# Altium schematic sheet Car_board.SchDoc
size A2; SheetNumber: 1; SheetTotal: 1
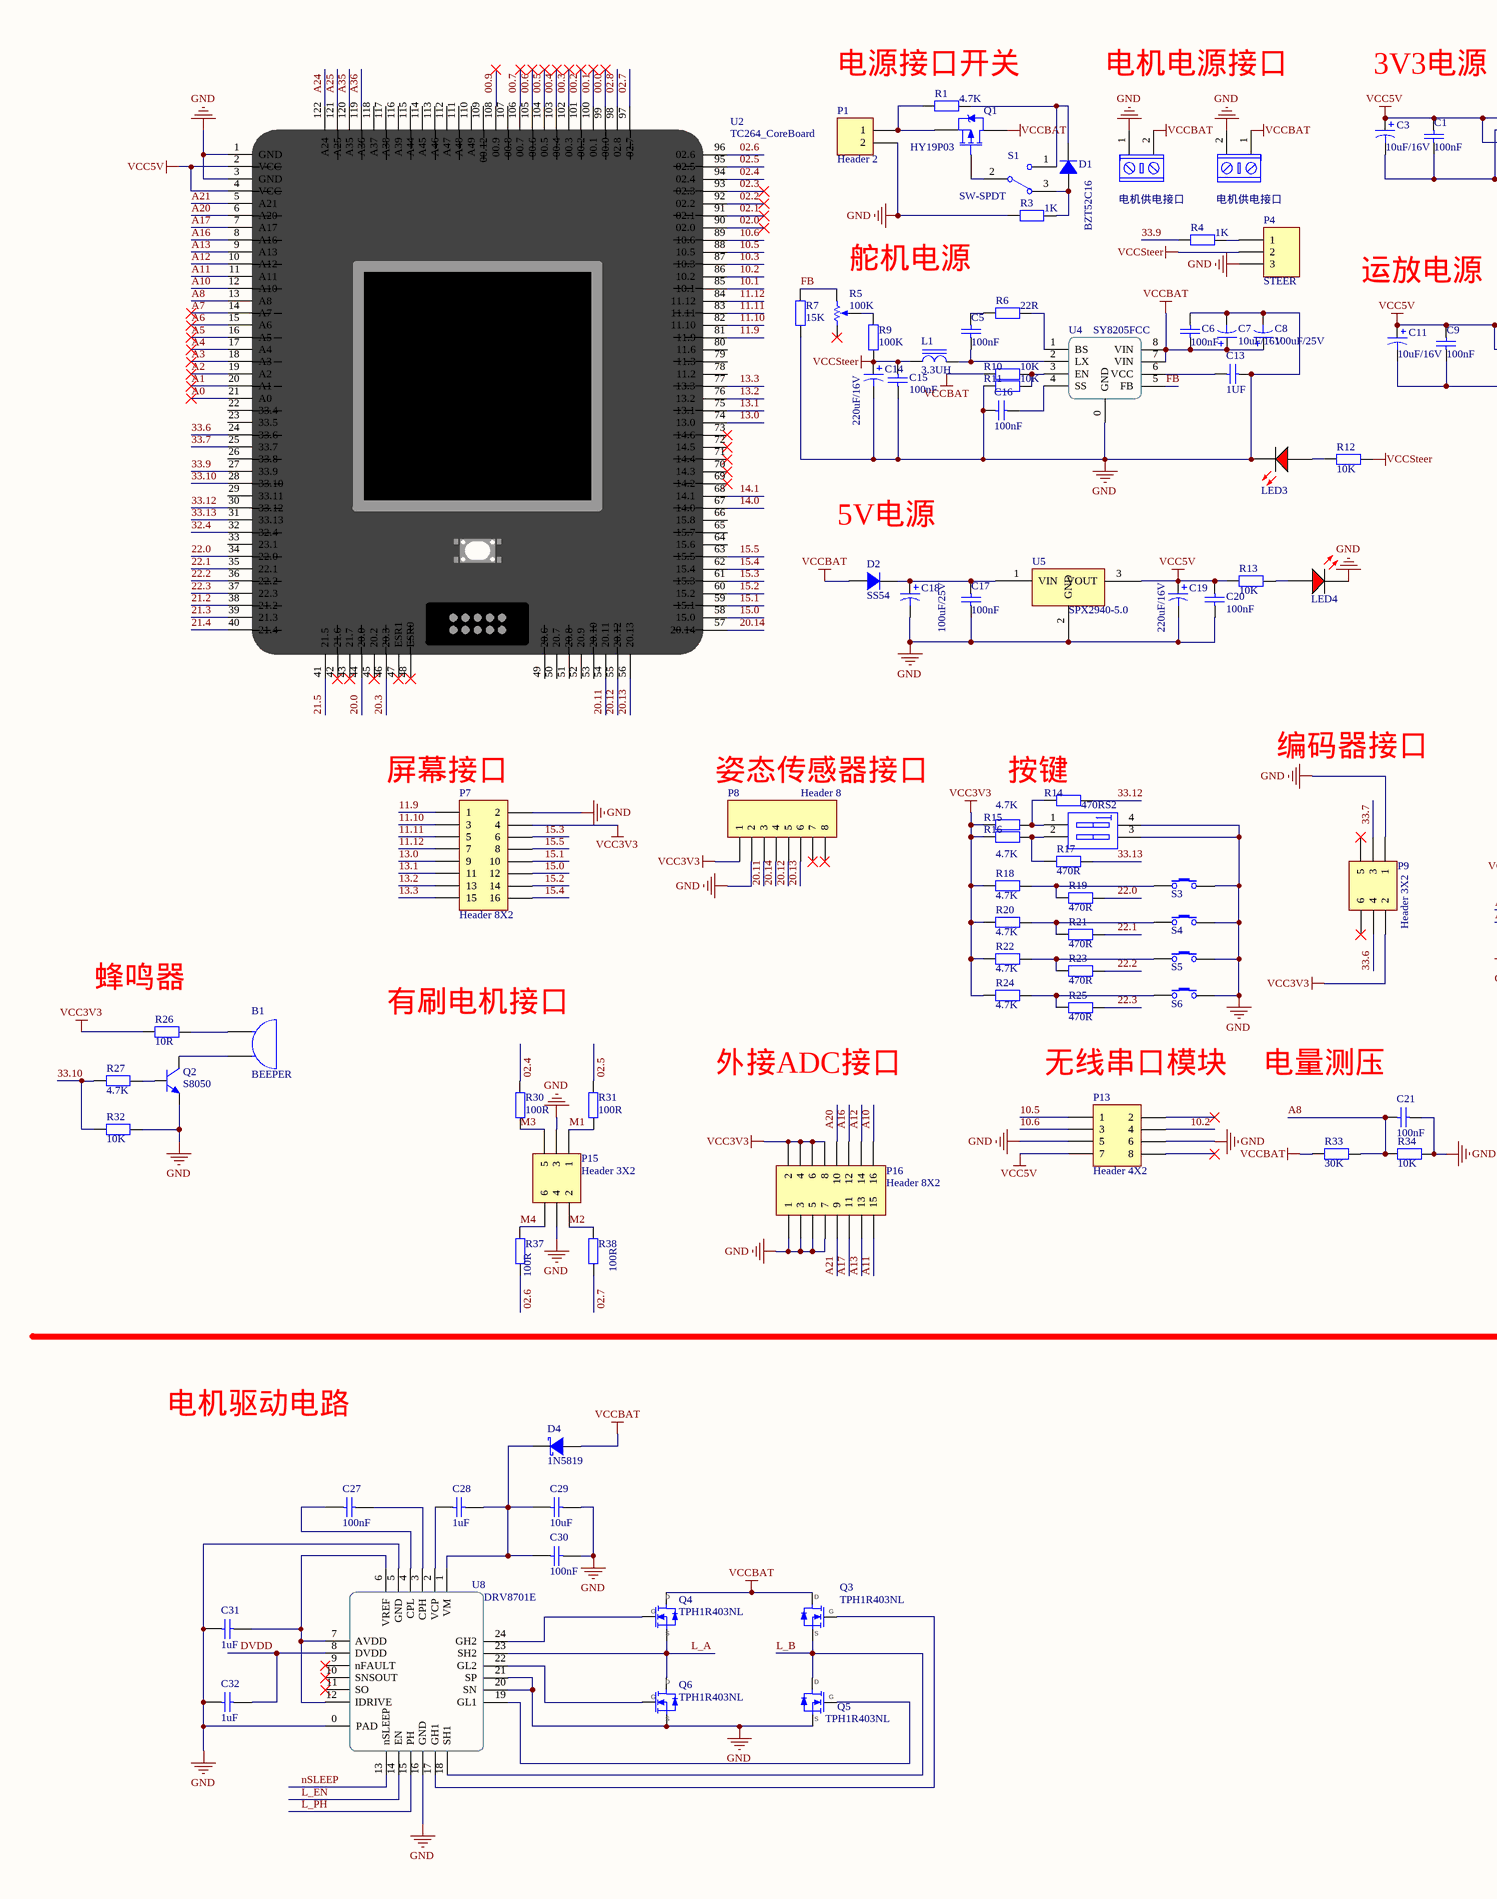
[diagram p0: Car_board.SchDoc, left]
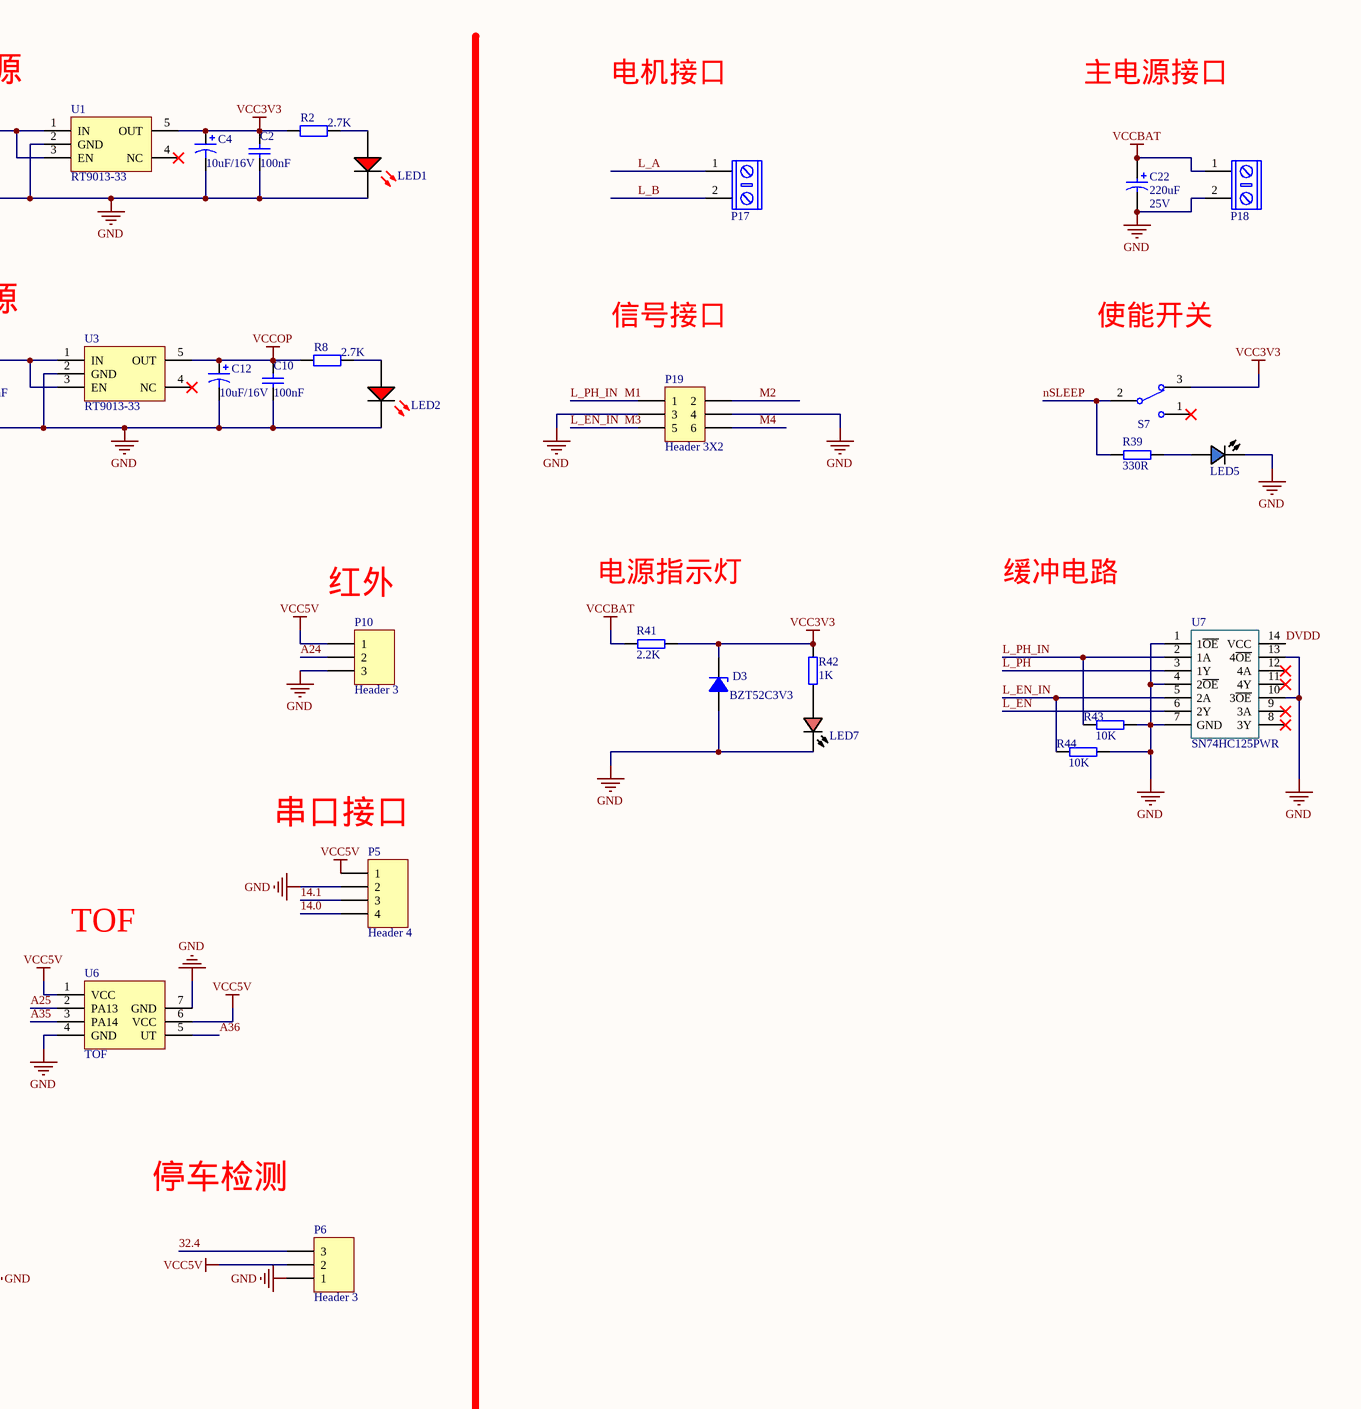
[diagram p1: Car_board.SchDoc, right]

## Parts
B1  BEEPER  [BEEPER]
C1  value 100nF  [0603C]  (hidden comment: Cap)
C2  value 100nF  [0603C]  (hidden comment: Cap)
C3  value 10uF/16V  [3216]  (hidden comment: Cap Pol2)
C4  value 10uF/16V  [3216]  (hidden comment: Cap Pol2)
C5  value 100nF  [0603C]  (hidden comment: Cap)
C6  value 100nF  [0603C]  (hidden comment: Cap)
C7  value 10uF/16V  [3216]  (hidden comment: Cap Pol2)
C8  value 100uF/25V  [CAPSO_6.3*7.7]  (hidden comment: Cap Pol2)
C9  value 100nF  [0603C]  (hidden comment: Cap)
C10  value 100nF  [0603C]  (hidden comment: Cap)
C11  value 10uF/16V  [3216]  (hidden comment: Cap Pol2)
C12  value 10uF/16V  [3216]  (hidden comment: Cap Pol2)
C13  value 1UF  [0603C]  (hidden comment: Cap)
C14  value 220uF/16V  [CAPSO_6.3*7.7]  (hidden comment: Cap Pol2)
C15  value 100nF  [0603C]  (hidden comment: Cap)
C16  value 100nF  [0603C]  (hidden comment: Cap)
C17  value 100nF  [0603C]  (hidden comment: Cap)
C18  value 100uF/25V  [CAPSO_6.3*7.7]  (hidden comment: Cap Pol2)
C19  value 220uF/16V  [CAPSO_6.3*7.7]  (hidden comment: Cap Pol2)
C20  value 100nF  [0603C]  (hidden comment: Cap)
C21  value 100nF  [0603C]  (hidden comment: Cap)
C22  value 220uF  Voltage: 25V  [CAPPR3.5-8X11.5]  (hidden comment: 220uF 25V)
C27  value 100nF  [CAPC1608[0603]S-N]  (hidden comment: 100nF ±10% 50V)
C28  value 1uF  [CAPC1608[0603]S-N]  (hidden comment: 1uF ±10% 25V)
C29  value 10uF  [CAPC2012[0805]S-N]  (hidden comment: 10uF ±10% 25V)
C30  value 100nF  [CAPC1608[0603]S-N]  (hidden comment: 100nF ±10% 50V)
C31  value 1uF  [CAPC1608[0603]S-N]  (hidden comment: 1uF ±10% 25V)
C32  value 1uF  [CAPC1608[0603]S-N]  (hidden comment: 1uF ±10% 25V)
D1  BZT52C16  [SOD-123]
D2  SS54  [SOD-123]
D3  BZT52C3V3  [SOD-123-L]
D4  1N5819  [SOD-123-L]
L1  3.3UH  [L-0630]
LED1  LED 3R  [0805D]  (value not drawn)
LED2  LED 3R  [0805D]  (value not drawn)
LED3  LED 3R  [0805D]  (value not drawn)
LED4  LED 3R  [0805D]  (value not drawn)
LED5  Blue  [LEDC1608(0603)]  (value not drawn)
LED7  (no value)  [LEDC1608(0603)]
P1  Header 2  [PCBComponent_1]
P2  电机供电接口  [KF/WJ/DG 301-2p-5.0mm]
P3  电机供电接口  [KF/WJ/DG 301-2p-5.0mm]
P4  STEER  [HDR1X3]
P5  Header 4  [HDR1X4]
P6  Header 3  [HDR1X3]
P7  Header 8X2  [HDR2X8]
P8  Header 8  [HDR1X8]
P9  Header 3X2  [HDR2X3]
P10  Header 3  [HDR1X3]
P13  Header 4X2  [HDR2X4]
P15  Header 3X2  [HDR2X3]
P16  Header 8X2  [HDR2X8]
P17  KF/WJ/DG 30x connecter  [KF/WJ/DG 301-2p-5.0mm]  (value not drawn)
P18  KF/WJ/DG 30x connecter  [KF/WJ/DG 301-2p-5.0mm]  (value not drawn)
P19  Header 3X2  [HDR2X3]
Q1  HY19P03  [TO-252]
Q2  S8050  [SOT-23]
Q3  TPH1R403NL  [DFN5x6]
Q4  TPH1R403NL  [DFN5x6]
Q5  TPH1R403NL  [DFN5x6]
Q6  TPH1R403NL  [DFN5x6]
R1  value 4.7K  [0603R]  (hidden comment: Res2)
R2  value 2.7K  [0603R]  (hidden comment: Res2)
R3  value 1K  [0603R]  (hidden comment: Res2)
R4  value 1K  [0603R]  (hidden comment: Res2)
R5  value 100K  [VR5_N]  (hidden comment: RPot)
R6  value 22R  [0603R]  (hidden comment: Res2)
R7  value 15K  [0603R]  (hidden comment: Res2)
R8  value 2.7K  [0603R]  (hidden comment: Res2)
R9  value 100K  [0603R]  (hidden comment: Res2)
R10  value 10K  [0603R]  (hidden comment: Res2)
R11  value 10K  [0603R]  (hidden comment: Res2)
R12  value 10K  [0603R]  (hidden comment: Res2)
R13  value 10K  [0603R]  (hidden comment: Res2)
R14  value 470R  [0603R]  (hidden comment: Res2)
R15  value 4.7K  [0603R]  (hidden comment: Res2)
R16  value 4.7K  [0603R]  (hidden comment: Res2)
R17  value 470R  [0603R]  (hidden comment: Res2)
R18  value 4.7K  [0603R]  (hidden comment: Res2)
R19  value 470R  [0603R]  (hidden comment: Res2)
R20  value 4.7K  [0603R]  (hidden comment: Res2)
R21  value 470R  [0603R]  (hidden comment: Res2)
R22  value 4.7K  [0603R]  (hidden comment: Res2)
R23  value 470R  [0603R]  (hidden comment: Res2)
R24  value 4.7K  [0603R]  (hidden comment: Res2)
R25  value 470R  [0603R]  (hidden comment: Res2)
R26  value 10R  [0603R]  (hidden comment: Res2)
R27  value 4.7K  [0603R]  (hidden comment: Res2)
R30  value 100R  [0603R]  (hidden comment: Res2)
R31  value 100R  [0603R]  (hidden comment: Res2)
R32  value 10K  [0603R]  (hidden comment: Res2)
R33  value 30K  [0603R]  (hidden comment: Res2)
R34  value 10K  [0603R]  (hidden comment: Res2)
R37  value 100R  [0603R]  (hidden comment: Res2)
R38  value 100R  [0603R]  (hidden comment: Res2)
R39  value 330R  [RESC1608[0603]S-N]  (hidden comment: 330R ±1%)
R41  value 2.2K  [RESC1608[0603]S-N]  (hidden comment: 2.2K ±1%)
R42  value 1K  [RESC1608[0603]S-N]  (hidden comment: 1K ±1%)
R43  value 10K  [RESC1608[0603]S-N]  (hidden comment: 10K ±1%)
R44  value 10K  [RESC1608[0603]S-N]  (hidden comment: 10K ±1%)
S1  SW-SPDT  [扭子开关102 - 2]
S2  SW DIP-2  [DIP4]  (value not drawn)
S3  Button  [KEY-2-SMD-3*6]  (value not drawn)
S4  Button  [KEY-2-SMD-3*6]  (value not drawn)
S5  Button  [KEY-2-SMD-3*6]  (value not drawn)
S6  Button  [KEY-2-SMD-3*6]  (value not drawn)
S7  SW-SPDT  [SS12D10]  (value not drawn)
U1  RT9013-33  [SOT-23-5]
U2  TC264_CoreBoard  [TC264_CoreBoard]
U3  RT9013-33  [SOT-23-5]
U4  SY8205FCC  [SOP-8E]
U5  SPX2940-5.0  [TO-263-3]
U6  TOF  [TOF]
U7  SN74HC125PWR  [TSSOP-14]
U8  DRV8701E  [QFN24-4x4]

## Nets
GND: C1.1 C2.1 C3.2 C4.2 C6.1 C7.2 C8.2 C9.1 C10.1 C11.2 C12.2 C13.2 C14.2 C15.2 C16.2 C17.1 C18.2 C19.2 C20.2 C21.1 C22.2 C29.2 C30.2 C31.1 C32.1 D3.A LED1.2(K) LED2.2(K) LED3.2(K) LED4.2(K) LED5.C LED7.C P1.2 P2.1 P3.2 P4.3 P5.2 P6.1 P7.2 P8.2 P9.1 P10.3 P13.5 P13.6 P15.3 P15.4 P16.1 P16.3 P16.5 P16.7 P18.2 P19.3 P19.4 Q2.2(E) Q5.3(S) Q6.3(S) R3.2 R7.1 R11.1 R32.1 R34.1 R43.2 R44.2 S2.3(B2) S2.4(B1) S3.1 S4.1 S5.1 S6.1 U1.2(GND) U2.1(GND) U2.3(GND) U3.2(GND) U4.0(GND) U5.2(GND) U6.4(GND) U6.7(GND) U7.1(1~{OE}) U7.4(2~{OE}) U7.7(GND) U7.10(3~{OE}) U7.13(4~{OE}) U8.0(PAD) U8.5(GND) U8.16(GND) U8.20(SN) U8.21(SP)
VCC3V3: C2.2 C4.1 D3.K P7.4 P8.1 P9.2 P16.2 P16.4 P16.6 P16.8 R2.1 R15.2 R16.2 R18.2 R20.2 R22.2 R24.2 R26.2 R41.2 R42.2 S7.3 U1.5(OUT)
VCC5V: C1.2 C3.1 C9.2 C11.1 C19.1 C20.1 P5.1 P6.2 P10.1 P13.7 R13.2 U1.1(IN) U1.3(EN) U2.2(VCC) U2.4(VCC) U3.1(IN) U3.3(EN) U5.3(VOUT) U6.1(VCC) U6.6(VCC)
VCCBAT: C6.2 C7.1 C8.1 C22.1 D2.1(A) D4.A P2.2 P3.1 P18.1 Q1.2(D) Q3.1(D) Q4.1(D) R10.1 R33.2 R41.1 U4.7(VIN) U4.8(VIN)
VCCOP: C10.2 C12.1 R8.1 U3.5(OUT)
VCCSteer: C14.1 C15.1 L1.1 P4.2 R9.1 R12.2
00.0: U2.99(00.0)
00.1: U2.100(00.1)
00.2: U2.101(00.2)
00.3: U2.102(00.3)
00.4: U2.103(00.4)
00.5: U2.104(00.5)
00.6: U2.105(00.6)
00.7: U2.106(00.7)
00.9: U2.108(00.9)
02.0: U2.90(02.0)
02.1: U2.91(02.1)
02.2: U2.92(02.2)
02.3: U2.93(02.3)
02.4: R30.1 U2.94(02.4)
02.5: R31.1 U2.95(02.5)
02.6: R37.2 U2.96(02.6)
02.7: R38.2 U2.97(02.7)
02.8: U2.98(02.8)
10.1: U2.85(10.1)
10.2: P13.4 U2.86(10.2)
10.3: U2.87(10.3)
10.5: P13.1 U2.88(10.5)
10.6: P13.3 U2.89(10.6)
11.9: P7.1 U2.81(11.9)
11.10: P7.3 U2.82(11.10)
11.11: P7.5 U2.83(11.11)
11.12: P7.7 U2.84(11.12)
13.0: P7.9 U2.74(13.0)
13.1: P7.11 U2.75(13.1)
13.2: P7.13 U2.76(13.2)
13.3: P7.15 U2.77(13.3)
14.0: P5.4 U2.67(14.0)
14.1: P5.3 U2.68(14.1)
15.0: P7.12 U2.58(15.0)
15.1: P7.10 U2.59(15.1)
15.2: P7.14 U2.60(15.2)
15.3: P7.6 U2.61(15.3)
15.4: P7.16 U2.62(15.4)
15.5: P7.8 U2.63(15.5)
20.0: U2.44(20.0)
20.3: U2.46(20.3)
20.11: P8.3 U2.54(20.11)
20.12: P8.5 U2.55(20.12)
20.13: P8.6 U2.56(20.13)
20.14: P8.4 U2.57(20.14)
21.2: U2.38(21.2)
21.3: U2.39(21.3)
21.4: U2.40(21.4)
21.5: U2.41(21.5)
22.0: R19.1 U2.34(22.0)
22.1: R21.1 U2.35(22.1)
22.2: R23.1 U2.36(22.2)
22.3: R25.1 U2.37(22.3)
32.4: P6.3 U2.32(32.4)
33.6: P9.4 U2.24(33.6)
33.7: P9.3 U2.25(33.7)
33.9: R4.1 U2.27(33.9)
33.10: R27.2 R32.2 U2.28(33.10)
33.12: R14.1 U2.30(33.12)
33.13: R17.1 U2.31(33.13)
A0: U2.21(A0)
A1: U2.20(A1)
A2: U2.19(A2)
A3: U2.18(A3)
A4: U2.17(A4)
A5: U2.16(A5)
A6: U2.15(A6)
A7: U2.14(A7)
A8: C21.2 R33.1 R34.2 U2.13(A8)
A10: P16.16 U2.12(A10)
A11: P16.15 U2.11(A11)
A12: P16.14 U2.10(A12)
A13: P16.13 U2.9(A13)
A16: P16.12 U2.8(A16)
A17: P16.11 U2.7(A17)
A20: P16.10 U2.6(A20)
A21: P16.9 U2.5(A21)
A24: P10.2 U2.122(A24)
A25: U2.121(A25) U6.2(PA13)
A35: U2.120(A35) U6.3(PA14)
A36: U2.119(A36) U6.5(UT)
DVDD: C32.2 U7.14(VCC) U8.8(DVDD)
FB: R5.3(BOT) R7.2 U4.5(FB)
L_A: P17.1 Q4.3(S) Q6.1(D) U8.23(SH2)
L_B: P17.2 Q3.3(S) Q5.1(D) U8.18(SH1)
L_EN: U7.6(2Y) U8.14(EN)
L_EN_IN: P15.5 P19.5 R30.2 R44.1 U7.5(2A)  [also labelled M3]
L_PH: U7.3(1Y) U8.15(PH)
L_PH_IN: P15.1 P19.1 R31.2 R43.1 U7.2(1A)  [also labelled M1]
M2: P15.2 P19.2 R38.1
M4: P15.6 P19.6 R37.1
nSLEEP: R39.1 S7.2 U8.13(nSLEEP)
NetB1_1: B1.1(A) R26.1
NetB1_2: B1.2(B) Q2.3(C)
NetC5_1: C5.1 L1.2 U4.2(LX)
NetC5_2: C5.2 R6.1
NetC13_1: C13.1 U4.6(VCC)
NetC16_1: C16.1 U4.4(SS)
NetC17_2: C17.2 C18.1 D2.2(K) U5.1(VIN)
NetC27_1: C27.1 U8.4(CPL)
NetC27_2: C27.2 U8.3(CPH)
NetC28_1: C28.1 U8.2(VCP)
NetC28_2: C28.2 C29.1 C30.1 D4.K U8.1(VM)
NetC31_2: C31.2 U8.6(VREF) U8.7(AVDD) U8.12(IDRIVE)
NetD1_1: D1.1(A) R3.1 S1.3
NetD1_2: D1.2(K) R1.1 S1.1
NetLED1_1: LED1.1(A) R2.2
NetLED2_1: LED2.1(A) R8.2
NetLED3_1: LED3.1(A) R12.1
NetLED4_1: LED4.1(A) R13.1
NetLED5_A: LED5.A R39.2
NetLED7_A: LED7.A R42.1
NetP1_1: P1.1 Q1.3(S) R1.2
NetP4_1: P4.1 R4.2
NetQ1_1: Q1.1(G) S1.2
NetQ2_1: Q2.1(B) R27.1
NetQ3_2: Q3.2(G) U8.17(GH1)
NetQ4_2: Q4.2(G) U8.24(GH2)
NetQ5_2: Q5.2(G) U8.19(GL1)
NetQ6_2: Q6.2(G) U8.22(GL2)
NetR5_2: R5.2(TAP) R9.2
NetR6_2: R6.2 U4.1(BS)
NetR10_2: R10.2 R11.2 U4.3(EN)
NetR14_2: R14.2 R15.1 S2.1(A1)
NetR16_1: R16.1 R17.2 S2.2(A2)
NetR18_1: R18.1 R19.2 S3.2
NetR20_1: R20.1 R21.2 S4.2
NetR22_1: R22.1 R23.2 S5.2
NetR24_1: R24.1 R25.2 S6.2

Not connected (* = marked no-connect by the designer): P8 7* 8*; P9 5* 6*; P13 2* 8*; R5 1(TOP)*; S7 1*; U1 4(NC)*; U2 22(33.4) 23(33.5) 26(33.8) 29(33.11) 33(23.1) 42(21.6)* 43(21.7)* 45(20.2)* 47(ESR1)* 48(ESR0)* 49(20.6) 50(20.7) 51(20.8) 52(20.9) 53(20.10) 64(15.6) 65(15.7) 66(15.8) 69(14.2)* 70(14.3)* 71(14.4)* 72(14.5)* 73(14.6)* 78(11.2) 79(11.3) 80(11.6) 107(00.8) 109(00.12) 110(A49) 111(A48) 112(A47) 113(A46) 114(A45) 115(A44) 116(A39) 117(A38) 118(A37); U3 4(NC)*; U7 8(3Y)* 9(3A)* 11(4Y)* 12(4A)*; U8 9(nFAULT)* 10(SNSOUT)* 11(SO)*

## Notes on the sheet
- (near R1) 电源接口开关
- 电机电源接口
- 3V3电源
- 电机接口
- 主电源接口
- (near R5) 舵机电源
- 运放电源
- 信号接口
- 使能开关
- 5V电源
- 电源指示灯
- 缓冲电路
- (near P10) 红外
- 编码器接口
- (near P5) 串口接口
- (near P7) 屏幕接口
- 姿态传感器接口
- (near R14) 按键
- TOF
- (near R26) 蜂鸣器
- 有刷电机接口
- 外接ADC接口
- 无线串口模块
- 电量测压
- 停车检测
- 电机驱动电路

## Library data of the parts
B1 = BUZZER: 3V蜂鸣器
C1 C2 C5 C6 C9 C10 C13 C15-C17 C20 C21 = Cap: 电容; PackageReference: RAD-0.3; Publisher: Altium Limited; PackageDescription: Radial Cap, Thru-Hole; 2 Leads; 0.3 in Pin Spacing
C3 C4 C7 C8 C11 C12 C14 C18 C19 = Cap Pol2: 钽电解电容/16V/A型封装; Published: 8-Jun-2000; LatestRevisionDate: 17-Jul-2002; LatestRevisionNote: Re-released for DXP Platform.; PackageReference: POLAR0.8; Publisher: Altium Limited; PackageDescription: Polarized Capacitor; 2 Leads
C22 = Cap-Elect: Polarized Capacitor (Radial); Published: 8-Jun-2000; Revision: July-2002: Re-released for DXP Platform.; Publisher: Altium Limited; Price(RMB): 0.000
C27 C30 = Cap-Chip_1: 贴片电容; Published: 8-Jun-2000; Revision: July-2002: Re-released for DXP Platform.; Publisher: Altium Limited; Price(RMB): 0.000; Voltage: 50V; Tolerance: ±10%
C28 C31 C32 = Cap-Chip_2: 贴片电容; Published: 8-Jun-2000; Revision: July-2002: Re-released for DXP Platform.; Publisher: Altium Limited; Price(RMB): 0.000; Voltage: 25V; Tolerance: ±10%
C29 = Cap-Chip: 贴片电容; Published: 8-Jun-2000; Revision: July-2002: Re-released for DXP Platform.; Publisher: Altium Limited; Price(RMB): 0.000; Voltage: 25V; Tolerance: ±10%
D1 D2 = TVS: TVS二极管 Diode; Imax: 500mA; Published: 8-Jun-2000; Revision: July-2002: Re-released for DXP Platform.; Publisher: Altium Limited; Price(RMB): 0.000
D3 = Diode Zen: 3.3V稳压二极管 SOD-123; Published: 8-Jun-2000; Revision: July-2002: Re-released for DXP Platform.; Publisher: Altium Limited; Price(RMB): 0.000
D4 = Diode Schottky: 肖特基二极管 Diode; Imax: 500mA; Published: 8-Jun-2000; Revision: July-2002: Re-released for DXP Platform.; Publisher: Altium Limited; Price(RMB): 0.000; PartNumber: 1N5819
L1 = Ind-Power: Power Inductor, Ferrite-Core; Imax: 50mA; DCR: .5m; Published: 8-Jun-2000; Revision: July-2002: Re-released for DXP Platform.; Publisher: Altium Limited; Price(RMB): 0.000; Value: 3.3UH
LED1-LED4 = LED DIP Red: Red, Typical INFRARED GaAs LED; Published: 8-Jun-2000; Revision: July-2002: Re-released for DXP Platform.; Publisher: Altium Limited; Price(RMB): 0.00
LED5 = LED Chip Blue: Typical Chip LED; Published: 8-Jun-2000; Revision: July-2002: Re-released for DXP Platform.; Publisher: Altium Limited; Price(RMB): 0.00; Color: Blue
LED7 = LED Chip Red: Typical Chip LED; Published: 8-Jun-2000; Revision: July-2002: Re-released for DXP Platform.; Publisher: Altium Limited; Price(RMB): 0.00
P1 = Header 2: Header, 2-Pin; LatestRevisionDate: 17-Jul-2002; LatestRevisionNote: Re-released for DXP Platform.; Publisher: Altium Limited
P2 P3 P17 P18 = KF/WJ/DG 30x: 接线端子 2Pin
P4 P6 P10 = Header 3: Header, 3-Pin; LatestRevisionDate: 17-Jul-2002; LatestRevisionNote: Re-released for DXP Platform.; Publisher: Altium Limited
P5 = Header 4: Header, 4-Pin; LatestRevisionDate: 17-Jul-2002; LatestRevisionNote: Re-released for DXP Platform.; Publisher: Altium Limited
P7 P16 = Header 8X2: Header, 8-Pin, Dual row; LatestRevisionDate: 17-Jul-2002; LatestRevisionNote: Re-released for DXP Platform.; Publisher: Altium Limited
P8 = Header 8: Header, 8-Pin; LatestRevisionDate: 17-Jul-2002; LatestRevisionNote: Re-released for DXP Platform.; Publisher: Altium Limited
P9 P15 P19 = Header 3X2: Header, 3-Pin, Dual row; LatestRevisionDate: 17-Jul-2002; LatestRevisionNote: Re-released for DXP Platform.; Publisher: Altium Limited
  P19: Price(RMB): 0.00
P13 = Header 4X2: Header, 4-Pin, Dual row; LatestRevisionDate: 17-Jul-2002; LatestRevisionNote: Re-released for DXP Platform.; Publisher: Altium Limited
Q1 = PMOS-2: P-Channel Power MOSFET; Note: Pin 4 not drawn and electrically connected to Pin 2.; Published: 8-Jun-2000; LatestRevisionDate: 17-Jul-2002; LatestRevisionNote: Re-released for DXP Platform.; DatasheetVersion: PD-9.390D; PackageVersion: Feb-1997; PackageReference: TO-220AB; Publisher: Altium Limited; PackageDescription: TO, Thru-Hole, Vertical, Heatsink Mounted; 3 In-Line Leads; Pitch 2.54 mm; ComponentLink1Description: Manufacturer Link; ComponentLink1URL: http://www.irf.com/
Q2 = NPN S8050: Discrete NPN Bipolar Transistor; Published: 8-Jun-2000; Revision: July-2002: Re-released for DXP Platform.; Publisher: Altium Limited; Price(RMB): 0.000; PartNumber: S8050
Q3-Q6 = TPH1R403NL: 东芝 N沟 MOS
R1-R4 R6-R27 R30-R34 R37 R38 = Res2: 电阻; Published: 8-Jun-2000; LatestRevisionDate: 17-Jul-2002; LatestRevisionNote: Re-released for DXP Platform.; PackageReference: AXIAL-0.4; Publisher: Altium Limited; PackageDescription: Axial Device, Thru-Hole; 2 Leads; 0.4 in Pin Spacing
R5 = RPot: 精密电位器; Sim Note: Enter the Resistance value and the set point into parameter fields.; Set Position: 0.5; Published: 8-Jun-2000; LatestRevisionDate: 17-Jul-2002; LatestRevisionNote: Re-released for DXP Platform.; PackageReference: VR5; Publisher: Altium Limited; PackageDescription: Variable Resistor, Thru-Hole; 3 Leads
R39 = Res-Chip_3: 贴片电阻; Published: 8-Jun-2000; Revision: July-2002: Re-released for DXP Platform.; Publisher: Altium Limited; Price(RMB): 0.000; Tolerance: ±1%
R41 = Res-Chip: 贴片电阻; Published: 8-Jun-2000; Revision: July-2002: Re-released for DXP Platform.; Publisher: Altium Limited; Price(RMB): 0.000; Tolerance: ±1%
R42 = Res-Chip_2: 贴片电阻; Published: 8-Jun-2000; Revision: July-2002: Re-released for DXP Platform.; Publisher: Altium Limited; Price(RMB): 0.000; Tolerance: ±1%
R43 R44 = Res-Chip_1: 贴片电阻; Published: 8-Jun-2000; Revision: July-2002: Re-released for DXP Platform.; Publisher: Altium Limited; Price(RMB): 0.000; Tolerance: ±1%
S1 = SW-SPDT: SPDT Subminiature Toggle Switch, Right Angle Mounting, Vertical Actuation; Published: 24-Mar-1999; LatestRevisionDate: 17-Dec-2003; LatestRevisionNote: Schematic revised, PCB Footprint replaced.; DatasheetVersion: 05-Dec-2000; PackageReference: TL36WW15050; Publisher: Altium Limited; PackageDescription: Switch; 4 Leads; ComponentLink1Description: Manufacturer Link; ComponentLink1URL: http://www.apem.com
S2 = Code SW-2: 2位拨码开关; Published: 24-Mar-1999; Revision: July-2002: Re-released for DXP Platform.; Publisher: Altium Limited; Price(RMB): 0.000
S3-S6 = KEY: 按键; Published: 24-Mar-1999; Publisher: Altium Limited; Price(RMB): 0.000
S7 = SW-SPDT: 单刀双掷开关 3脚船型、钮子、拨动开关 SPDT Subminiature Toggle Switch; Published: 24-Mar-1999; Publisher: Altium Limited; Price(RMB): 0.000
U1 U3 = RT9013-33: 3.3V 500mA SOT-23-5 LDO
U2 = TC264_CoreBoard: 逐飞科技TC264核心板
U4 = SY8205FCC: 同步buck
U5 = SPX2940-5.0: SPX2940-5.0 5V LDO TO-263-3
U7 = SN74HC125PWR: 三态输出的四路缓冲器 TSSOP-20
U8 = DRV8701E: DRV8701E Ti全桥驱动芯片